# Altium schematic sheet S7CAS-PLEIADES-CARTE-MERE_P02_FPGA_B2B3.SchDoc
size Tabloid; DocumentNumber: 6; SheetNumber: 6; SheetTotal: 14; Size: 11x17; Sheet_Name: FPGA Bank2-3
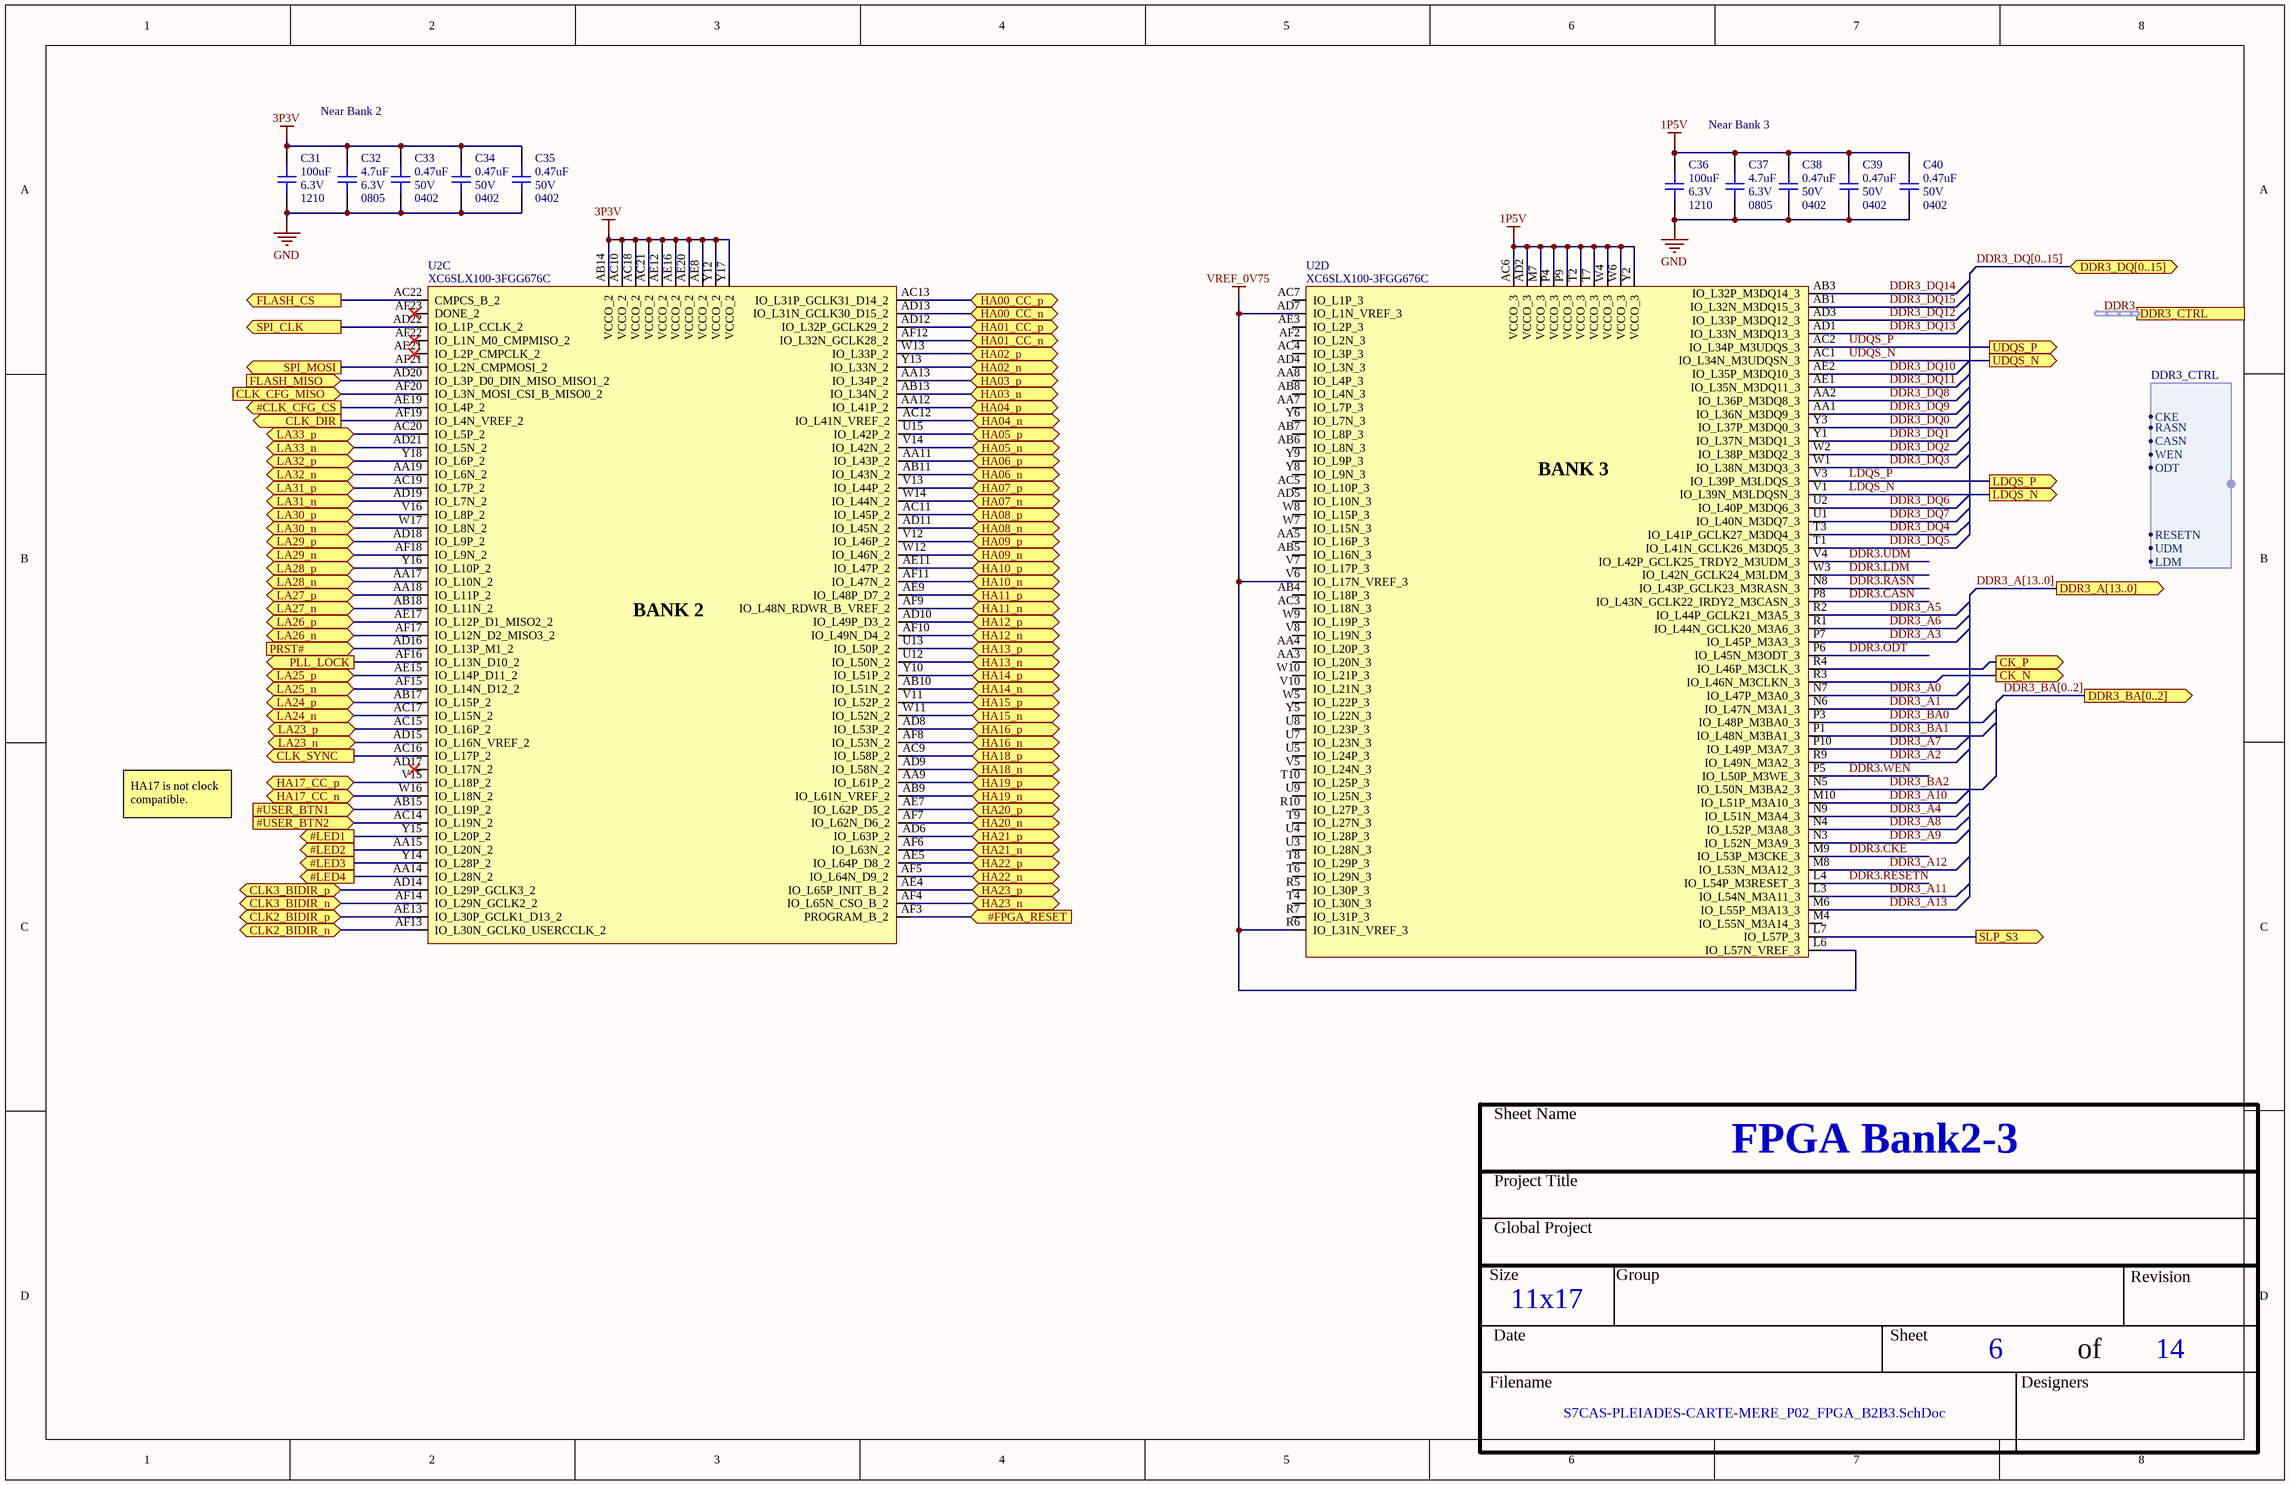
[diagram p0: S7CAS-PLEIADES-CARTE-MERE_P02_FPGA_B2B3.SchDoc]

## Parts
C31  value 100uF  Voltage: 6.3V  Package: 1210  [CAP_1210]  (hidden comment: CAP - 1210)
C32  value 4.7uF  Voltage: 6.3V  Package: 0805  [CAP_0805]  (hidden comment: CAP - 0805)
C33  value 0.47uF  Voltage: 50V  Package: 0402  [CAP_0402]  (hidden comment: CAP - 0402)
C34  value 0.47uF  Voltage: 50V  Package: 0402  [CAP_0402]  (hidden comment: CAP - 0402)
C35  value 0.47uF  Voltage: 50V  Package: 0402  [CAP_0402]  (hidden comment: CAP - 0402)
C36  value 100uF  Voltage: 6.3V  Package: 1210  [CAP_1210]  (hidden comment: CAP - 1210)
C37  value 4.7uF  Voltage: 6.3V  Package: 0805  [CAP_0805]  (hidden comment: CAP - 0805)
C38  value 0.47uF  Voltage: 50V  Package: 0402  [CAP_0402]  (hidden comment: CAP - 0402)
C39  value 0.47uF  Voltage: 50V  Package: 0402  [CAP_0402]  (hidden comment: CAP - 0402)
C40  value 0.47uF  Voltage: 50V  Package: 0402  [CAP_0402]  (hidden comment: CAP - 0402)
U2  XC6SLX100-3FGG676C  [FPGA_XILINX_FGG676]  (parts C,D of 10)

## Ports
#CLK_CFG_CS (out), #FPGA_RESET (in), #LED1 (out), #LED2 (out), #LED3 (out), #LED4 (out), #USER_BTN1 (in), #USER_BTN2 (in), CK_N (out), CK_P (out), CLK2_BIDIR_n (bidir), CLK2_BIDIR_p (bidir), CLK3_BIDIR_n (bidir), CLK3_BIDIR_p (bidir), CLK_CFG_MISO (in), CLK_DIR (out), CLK_SYNC (out), DDR3_A[13..0] (out), DDR3_BA[0..2] (out), DDR3_CTRL (harness DDR_CTRL), DDR3_DQ[0..15] (bidir), FLASH_CS (out), FLASH_MISO (in), HA00_CC_n (bidir), HA00_CC_p (bidir), HA01_CC_n (bidir), HA01_CC_p (bidir), HA02_n (bidir), HA02_p (bidir), HA03_n (bidir), HA03_p (bidir), HA04_n (bidir), HA04_p (bidir), HA05_n (bidir), HA05_p (bidir), HA06_n (bidir), HA06_p (bidir), HA07_n (bidir), HA07_p (bidir), HA08_n (bidir), HA08_p (bidir), HA09_n (bidir), HA09_p (bidir), HA10_n (bidir), HA10_p (bidir), HA11_n (bidir), HA11_p (bidir), HA12_n (bidir), HA12_p (bidir), HA13_n (bidir), HA13_p (bidir), HA14_n (bidir), HA14_p (bidir), HA15_n (bidir), HA15_p (bidir), HA16_n (bidir), HA16_p (bidir), HA17_CC_n (bidir), HA17_CC_p (bidir), HA18_n (bidir), HA18_p (bidir), HA19_n (bidir), HA19_p (bidir), HA20_n (bidir), HA20_p (bidir), HA21_n (bidir), HA21_p (bidir), HA22_n (bidir), HA22_p (bidir), HA23_n (bidir), HA23_p (bidir), LA23_n (bidir), LA23_p (bidir), LA24_n (bidir), LA24_p (bidir), LA25_n (bidir), LA25_p (bidir), LA26_n (bidir), LA26_p (bidir), LA27_n (bidir), LA27_p (bidir), LA28_n (bidir), LA28_p (bidir), LA29_n (bidir), LA29_p (bidir), LA30_n (bidir), LA30_p (bidir), LA31_n (bidir), LA31_p (bidir), LA32_n (bidir), LA32_p (bidir), LA33_n (bidir), LA33_p (bidir), LDQS_N (out), LDQS_P (out), PLL_LOCK (out), PRST# (in), SLP_S3 (out), SPI_CLK (out), SPI_MOSI (out), UDQS_N (out), UDQS_P (out)

## Harnesses
DDR3_CTRL: CKE, RASN, CASN, WEN, ODT, RESETN, UDM, LDM

## Nets
1P5V: C36.2 C37.2 C38.2 C39.2 C40.2 U2.AC6(VCCO_3) U2.AD2(VCCO_3) U2.M7(VCCO_3) U2.P4(VCCO_3) U2.P9(VCCO_3) U2.T2(VCCO_3) U2.T7(VCCO_3) U2.W4(VCCO_3) U2.W6(VCCO_3) U2.Y2(VCCO_3)
3P3V: C31.2 C32.2 C33.2 C34.2 C35.2 U2.AB14(VCCO_2) U2.AC10(VCCO_2) U2.AC18(VCCO_2) U2.AC21(VCCO_2) U2.AE8(VCCO_2) U2.AE12(VCCO_2) U2.AE16(VCCO_2) U2.AE20(VCCO_2) U2.Y12(VCCO_2) U2.Y17(VCCO_2)
GND: C31.1 C32.1 C33.1 C34.1 C35.1 C36.1 C37.1 C38.1 C39.1 C40.1
VREF_0V75: U2.AD7(IO_L1N_VREF_3) U2.L6(IO_L57N_VREF_3) U2.R6(IO_L31N_VREF_3) U2.V6(IO_L17N_VREF_3)
#CLK_CFG_CS: U2.AE19(IO_L4P_2) ; port #CLK_CFG_CS
#FPGA_RESET: U2.AF3(PROGRAM_B_2) ; port #FPGA_RESET
#LED1: U2.Y15(IO_L20P_2) ; port #LED1
#LED2: U2.AA15(IO_L20N_2) ; port #LED2
#LED3: U2.Y14(IO_L28P_2) ; port #LED3
#LED4: U2.AA14(IO_L28N_2) ; port #LED4
#USER_BTN1: U2.AB15(IO_L19P_2) ; port #USER_BTN1
#USER_BTN2: U2.AC14(IO_L19N_2) ; port #USER_BTN2
CK_N: U2.R3(IO_L46N_M3CLKN_3) ; port CK_N
CK_P: U2.R4(IO_L46P_M3CLK_3) ; port CK_P
CLK2_BIDIR_n: U2.AF13(IO_L30N_GCLK0_USERCCLK_2) ; port CLK2_BIDIR_n
CLK2_BIDIR_p: U2.AE13(IO_L30P_GCLK1_D13_2) ; port CLK2_BIDIR_p
CLK3_BIDIR_n: U2.AF14(IO_L29N_GCLK2_2) ; port CLK3_BIDIR_n
CLK3_BIDIR_p: U2.AD14(IO_L29P_GCLK3_2) ; port CLK3_BIDIR_p
CLK_CFG_MISO: U2.AF20(IO_L3N_MOSI_CSI_B_MISO0_2) ; port CLK_CFG_MISO
CLK_DIR: U2.AF19(IO_L4N_VREF_2) ; port CLK_DIR
CLK_SYNC: U2.AC16(IO_L17P_2) ; port CLK_SYNC
DDR3.CASN: U2.P8(IO_L43N_GCLK22_IRDY2_M3CASN_3)
DDR3.CKE: U2.M9(IO_L53P_M3CKE_3)
DDR3.LDM: U2.W3(IO_L42N_GCLK24_M3LDM_3)
DDR3.ODT: U2.P6(IO_L45N_M3ODT_3)
DDR3.RASN: U2.N8(IO_L43P_GCLK23_M3RASN_3)
DDR3.RESETN: U2.L4(IO_L54P_M3RESET_3)
DDR3.UDM: U2.V4(IO_L42P_GCLK25_TRDY2_M3UDM_3)
DDR3.WEN: U2.P5(IO_L50P_M3WE_3)
DDR3_A0: U2.N7(IO_L47P_M3A0_3)
DDR3_A1: U2.N6(IO_L47N_M3A1_3)
DDR3_A2: U2.R9(IO_L49N_M3A2_3)
DDR3_A3: U2.P7(IO_L45P_M3A3_3)
DDR3_A4: U2.N9(IO_L51N_M3A4_3)
DDR3_A5: U2.R2(IO_L44P_GCLK21_M3A5_3)
DDR3_A6: U2.R1(IO_L44N_GCLK20_M3A6_3)
DDR3_A7: U2.P10(IO_L49P_M3A7_3)
DDR3_A8: U2.N4(IO_L52P_M3A8_3)
DDR3_A9: U2.N3(IO_L52N_M3A9_3)
DDR3_A10: U2.M10(IO_L51P_M3A10_3)
DDR3_A11: U2.L3(IO_L54N_M3A11_3)
DDR3_A12: U2.M8(IO_L53N_M3A12_3)
DDR3_A13: U2.M6(IO_L55P_M3A13_3)
DDR3_BA0: U2.P3(IO_L48P_M3BA0_3)
DDR3_BA1: U2.P1(IO_L48N_M3BA1_3)
DDR3_BA2: U2.N5(IO_L50N_M3BA2_3)
DDR3_DQ0: U2.Y3(IO_L37P_M3DQ0_3)
DDR3_DQ1: U2.Y1(IO_L37N_M3DQ1_3)
DDR3_DQ2: U2.W2(IO_L38P_M3DQ2_3)
DDR3_DQ3: U2.W1(IO_L38N_M3DQ3_3)
DDR3_DQ4: U2.T3(IO_L41P_GCLK27_M3DQ4_3)
DDR3_DQ5: U2.T1(IO_L41N_GCLK26_M3DQ5_3)
DDR3_DQ6: U2.U2(IO_L40P_M3DQ6_3)
DDR3_DQ7: U2.U1(IO_L40N_M3DQ7_3)
DDR3_DQ8: U2.AA2(IO_L36P_M3DQ8_3)
DDR3_DQ9: U2.AA1(IO_L36N_M3DQ9_3)
DDR3_DQ10: U2.AE2(IO_L35P_M3DQ10_3)
DDR3_DQ11: U2.AE1(IO_L35N_M3DQ11_3)
DDR3_DQ12: U2.AD3(IO_L33P_M3DQ12_3)
DDR3_DQ13: U2.AD1(IO_L33N_M3DQ13_3)
DDR3_DQ14: U2.AB3(IO_L32P_M3DQ14_3)
DDR3_DQ15: U2.AB1(IO_L32N_M3DQ15_3)
FLASH_CS: U2.AC22(CMPCS_B_2) ; port FLASH_CS
FLASH_MISO: U2.AD20(IO_L3P_D0_DIN_MISO_MISO1_2) ; port FLASH_MISO
HA00_CC_n: U2.AD13(IO_L31N_GCLK30_D15_2) ; port HA00_CC_n
HA00_CC_p: U2.AC13(IO_L31P_GCLK31_D14_2) ; port HA00_CC_p
HA01_CC_n: U2.AF12(IO_L32N_GCLK28_2) ; port HA01_CC_n
HA01_CC_p: U2.AD12(IO_L32P_GCLK29_2) ; port HA01_CC_p
HA02_n: U2.Y13(IO_L33N_2) ; port HA02_n
HA02_p: U2.W13(IO_L33P_2) ; port HA02_p
HA03_n: U2.AB13(IO_L34N_2) ; port HA03_n
HA03_p: U2.AA13(IO_L34P_2) ; port HA03_p
HA04_n: U2.AC12(IO_L41N_VREF_2) ; port HA04_n
HA04_p: U2.AA12(IO_L41P_2) ; port HA04_p
HA05_n: U2.V14(IO_L42N_2) ; port HA05_n
HA05_p: U2.U15(IO_L42P_2) ; port HA05_p
HA06_n: U2.AB11(IO_L43N_2) ; port HA06_n
HA06_p: U2.AA11(IO_L43P_2) ; port HA06_p
HA07_n: U2.W14(IO_L44N_2) ; port HA07_n
HA07_p: U2.V13(IO_L44P_2) ; port HA07_p
HA08_n: U2.AD11(IO_L45N_2) ; port HA08_n
HA08_p: U2.AC11(IO_L45P_2) ; port HA08_p
HA09_n: U2.W12(IO_L46N_2) ; port HA09_n
HA09_p: U2.V12(IO_L46P_2) ; port HA09_p
HA10_n: U2.AF11(IO_L47N_2) ; port HA10_n
HA10_p: U2.AE11(IO_L47P_2) ; port HA10_p
HA11_n: U2.AF9(IO_L48N_RDWR_B_VREF_2) ; port HA11_n
HA11_p: U2.AE9(IO_L48P_D7_2) ; port HA11_p
HA12_n: U2.AF10(IO_L49N_D4_2) ; port HA12_n
HA12_p: U2.AD10(IO_L49P_D3_2) ; port HA12_p
HA13_n: U2.U12(IO_L50N_2) ; port HA13_n
HA13_p: U2.U13(IO_L50P_2) ; port HA13_p
HA14_n: U2.AB10(IO_L51N_2) ; port HA14_n
HA14_p: U2.Y10(IO_L51P_2) ; port HA14_p
HA15_n: U2.W11(IO_L52N_2) ; port HA15_n
HA15_p: U2.V11(IO_L52P_2) ; port HA15_p
HA16_n: U2.AF8(IO_L53N_2) ; port HA16_n
HA16_p: U2.AD8(IO_L53P_2) ; port HA16_p
HA17_CC_n: U2.W16(IO_L18N_2) ; port HA17_CC_n
HA17_CC_p: U2.V15(IO_L18P_2) ; port HA17_CC_p
HA18_n: U2.AD9(IO_L58N_2) ; port HA18_n
HA18_p: U2.AC9(IO_L58P_2) ; port HA18_p
HA19_n: U2.AB9(IO_L61N_VREF_2) ; port HA19_n
HA19_p: U2.AA9(IO_L61P_2) ; port HA19_p
HA20_n: U2.AF7(IO_L62N_D6_2) ; port HA20_n
HA20_p: U2.AE7(IO_L62P_D5_2) ; port HA20_p
HA21_n: U2.AF6(IO_L63N_2) ; port HA21_n
HA21_p: U2.AD6(IO_L63P_2) ; port HA21_p
HA22_n: U2.AF5(IO_L64N_D9_2) ; port HA22_n
HA22_p: U2.AE5(IO_L64P_D8_2) ; port HA22_p
HA23_n: U2.AF4(IO_L65N_CSO_B_2) ; port HA23_n
HA23_p: U2.AE4(IO_L65P_INIT_B_2) ; port HA23_p
LA23_n: U2.AD15(IO_L16N_VREF_2) ; port LA23_n
LA23_p: U2.AC15(IO_L16P_2) ; port LA23_p
LA24_n: U2.AC17(IO_L15N_2) ; port LA24_n
LA24_p: U2.AB17(IO_L15P_2) ; port LA24_p
LA25_n: U2.AF15(IO_L14N_D12_2) ; port LA25_n
LA25_p: U2.AE15(IO_L14P_D11_2) ; port LA25_p
LA26_n: U2.AF17(IO_L12N_D2_MISO3_2) ; port LA26_n
LA26_p: U2.AE17(IO_L12P_D1_MISO2_2) ; port LA26_p
LA27_n: U2.AB18(IO_L11N_2) ; port LA27_n
LA27_p: U2.AA18(IO_L11P_2) ; port LA27_p
LA28_n: U2.AA17(IO_L10N_2) ; port LA28_n
LA28_p: U2.Y16(IO_L10P_2) ; port LA28_p
LA29_n: U2.AF18(IO_L9N_2) ; port LA29_n
LA29_p: U2.AD18(IO_L9P_2) ; port LA29_p
LA30_n: U2.W17(IO_L8N_2) ; port LA30_n
LA30_p: U2.V16(IO_L8P_2) ; port LA30_p
LA31_n: U2.AD19(IO_L7N_2) ; port LA31_n
LA31_p: U2.AC19(IO_L7P_2) ; port LA31_p
LA32_n: U2.AA19(IO_L6N_2) ; port LA32_n
LA32_p: U2.Y18(IO_L6P_2) ; port LA32_p
LA33_n: U2.AD21(IO_L5N_2) ; port LA33_n
LA33_p: U2.AC20(IO_L5P_2) ; port LA33_p
LDQS_N: U2.V1(IO_L39N_M3LDQSN_3) ; port LDQS_N
LDQS_P: U2.V3(IO_L39P_M3LDQS_3) ; port LDQS_P
PLL_LOCK: U2.AF16(IO_L13N_D10_2) ; port PLL_LOCK
PRST#: U2.AD16(IO_L13P_M1_2) ; port PRST#
SLP_S3: U2.L7(IO_L57P_3) ; port SLP_S3
SPI_CLK: U2.AD22(IO_L1P_CCLK_2) ; port SPI_CLK
SPI_MOSI: U2.AF21(IO_L2N_CMPMOSI_2) ; port SPI_MOSI
UDQS_N: U2.AC1(IO_L34N_M3UDQSN_3) ; port UDQS_N
UDQS_P: U2.AC2(IO_L34P_M3UDQS_3) ; port UDQS_P

Not connected (* = marked no-connect by the designer): U2 AA3(IO_L20N_3) AA4(IO_L20P_3) AA5(IO_L16P_3) AA7(IO_L7P_3) AA8(IO_L4P_3) AB4(IO_L18P_3) AB5(IO_L16N_3) AB6(IO_L8N_3) AB7(IO_L8P_3) AB8(IO_L4N_3) AC3(IO_L18N_3) AC4(IO_L3P_3) AC5(IO_L10P_3) AC7(IO_L1P_3) AD4(IO_L3N_3) AD5(IO_L10N_3) AD17(IO_L17N_2)* AE3(IO_L2P_3) AE21(IO_L2P_CMPCLK_2)* AF2(IO_L2N_3) AF22(IO_L1N_M0_CMPMISO_2)* AF23(DONE_2)* M4(IO_L55N_M3A14_3) R5(IO_L30P_3) R7(IO_L31P_3) R10(IO_L27P_3) T4(IO_L30N_3) T6(IO_L29N_3) T8(IO_L29P_3) T9(IO_L27N_3) T10(IO_L25P_3) U3(IO_L28N_3) U4(IO_L28P_3) U5(IO_L24P_3) U7(IO_L23N_3) U8(IO_L23P_3) U9(IO_L25N_3) V5(IO_L24N_3) V7(IO_L17P_3) V8(IO_L19N_3) V10(IO_L21N_3) W5(IO_L22P_3) W7(IO_L15N_3) W8(IO_L15P_3) W9(IO_L19P_3) W10(IO_L21P_3) Y5(IO_L22N_3) Y6(IO_L7N_3) Y8(IO_L9N_3) Y9(IO_L9P_3)

## Buses and harness runs
bus DDR3_A[13..0] = port DDR3_A[13..0]
bus DDR3_BA[0..2] = port DDR3_BA[0..2]
bus DDR3_DQ[0..15] = port DDR3_DQ[0..15]
harness DDR3 = port DDR3_CTRL

## Notes on the sheet
- Near Bank 2
- Near Bank 3
- HA17 is not clock compatible.
- Sheet Name
- Project Title
- Global Project
- Size
- Group
- Revision
- Date
- Sheet
- of
- Filename
- Designers
- (in symbol FPGA_XC6SLX100-3FGG676C, part C) BANK 2
- (in symbol FPGA_XC6SLX100-3FGG676C, part D) BANK 3

## Library data of the parts
C31 C36 = CAP - 1210: Precision: 10%; Current: *; CreatedBy: Jonathan Bouchard; Power: *
C32 C37 = CAP - 0805: Precision: 10%; Current: *; CreatedBy: Jonathan Bouchard; Power: *
C33-C35 C38-C40 = CAP - 0402: Precision: 10%; Current: *; CreatedBy: Jonathan Bouchard; Power: *
U2 = FPGA_XC6SLX100-3FGG676C: FPGA - XILINX SPARTAN 6 480 I/O - BGA-676; Voltage: 1.14 V ~ 1.26 V; Current: *; Power: *; Mfg: Xilinx; Mfg Part Number: XC6SLX100-3FGG676C; HelpURL: https://www.xilinx.com/support/documentation/data_sheets/ds162.pdf; CreatedBy: Jonathan Bouchard; Temperature: 0°C ~ 85°C (TJ); Value: *; Precision: *; Package: BGA-676; Supplier 1: Digikey; Supplier Part Number 1: 122-1760-ND